# Altium project Thermistor_Expansion_TopBoard.PrjPcb
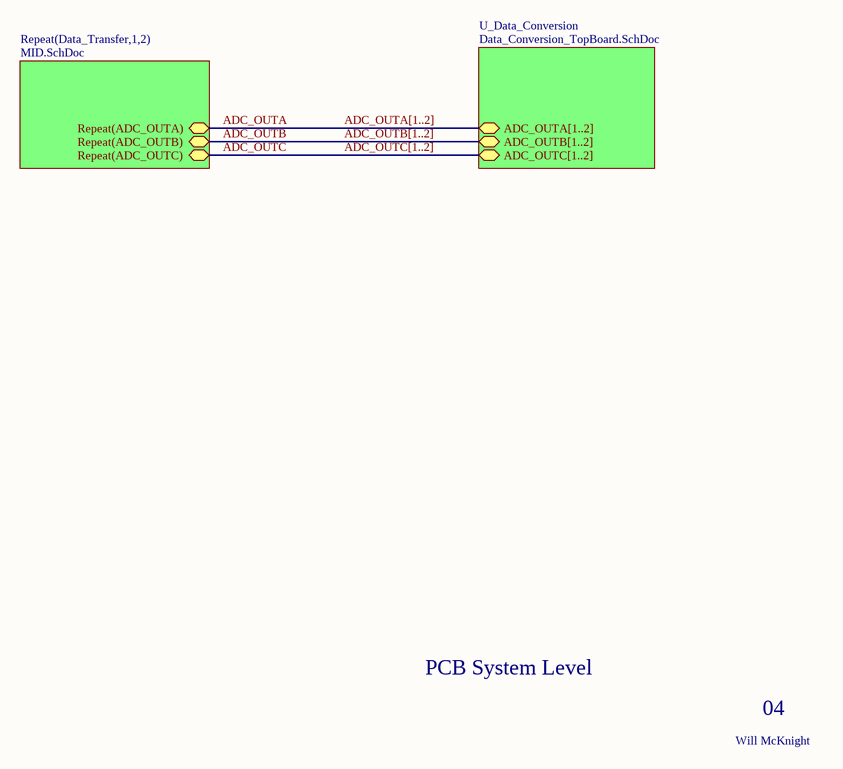
[diagram p0: TOP_Level_Sheet_TopBoard.SchDoc]
5 sheets, 64 parts. Net scope: hierarchical (ports join the sheet entries above them; power ports are global).
Board file: Therm_Expand_PCB_Bottom.PcbDoc
Sheets:
  TOP_Level_Sheet_TopBoard.SchDoc
    Data_Transfer1 = MID.SchDoc
      U_AHK50H-ND_THERM_CONNECTOR = 50Pin_Connector.SchDoc
      U_Single_Mux = Multiplexers.SchDoc
    Data_Transfer2 = MID.SchDoc
      U_AHK50H-ND_THERM_CONNECTOR = 50Pin_Connector.SchDoc
      U_Single_Mux = Multiplexers.SchDoc
    U_Data_Conversion = Data_Conversion_TopBoard.SchDoc

## Sheet TOP_Level_Sheet_TopBoard.SchDoc
size A

### Sub-sheets
Repeat(Data_Transfer,1,2) = MID.SchDoc: Repeat(ADC_OUTA) (bidir), Repeat(ADC_OUTB) (bidir), Repeat(ADC_OUTC) (bidir)
U_Data_Conversion = Data_Conversion_TopBoard.SchDoc: ADC_OUTA[1..2] (bidir), ADC_OUTB[1..2] (bidir), ADC_OUTC[1..2] (bidir)

### Nets
ADC_OUTA: sheet Repeat(Data_Transfer,1,2)/Repeat(ADC_OUTA)
ADC_OUTB: sheet Repeat(Data_Transfer,1,2)/Repeat(ADC_OUTB)
ADC_OUTC: sheet Repeat(Data_Transfer,1,2)/Repeat(ADC_OUTC)

### Buses and harness runs
bus ADC_OUTA[1..2] = sheet U_Data_Conversion/ADC_OUTA[1..2]
bus ADC_OUTB[1..2] = sheet U_Data_Conversion/ADC_OUTB[1..2]
bus ADC_OUTC[1..2] = sheet U_Data_Conversion/ADC_OUTC[1..2]

### Notes on the sheet
- PCB System Level
- 04
- Will McKnight

## Sheet MID.SchDoc
size A
Used 2 times, as channels Data_Transfer1, Data_Transfer2. Parts and nets are listed once, with the designators drawn on the sheet.
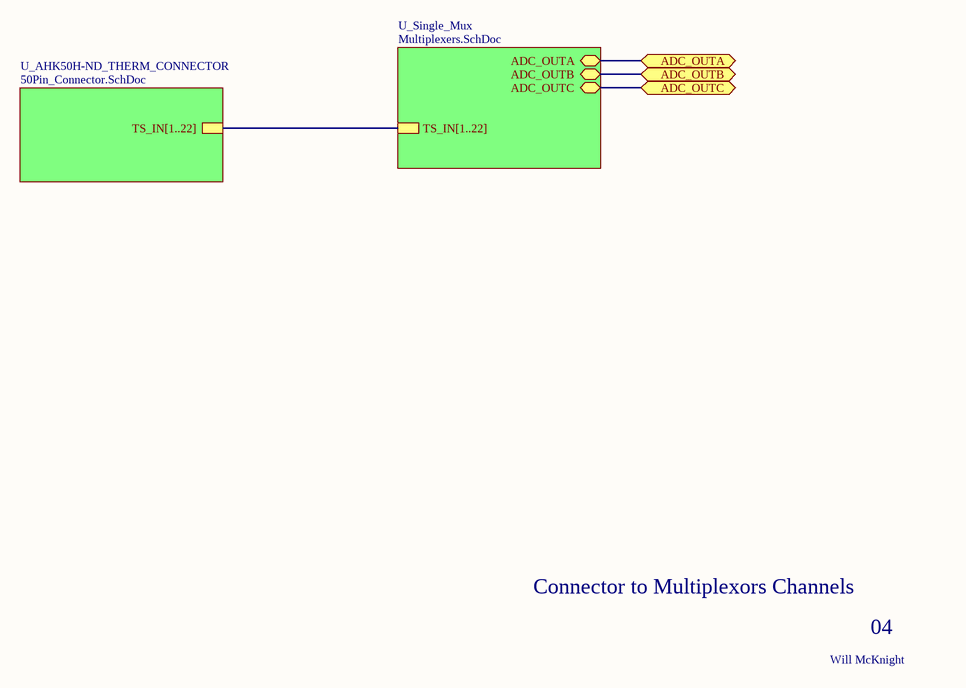
[diagram p1: MID.SchDoc]

### Sub-sheets
U_AHK50H-ND_THERM_CONNECTOR = 50Pin_Connector.SchDoc: TS_IN[1..22]
U_Single_Mux = Multiplexers.SchDoc: ADC_OUTA (bidir), TS_IN[1..22], ADC_OUTB (bidir), ADC_OUTC (bidir)

### Ports
ADC_OUTA (bidir), ADC_OUTB (bidir), ADC_OUTC (bidir)

### Nets
ADC_OUTA: port ADC_OUTA, sheet U_Single_Mux/ADC_OUTA
ADC_OUTB: port ADC_OUTB, sheet U_Single_Mux/ADC_OUTB
ADC_OUTC: port ADC_OUTC, sheet U_Single_Mux/ADC_OUTC

### Channels
Data_Transfer1: ports ADC_OUTA=ADC_OUTA ADC_OUTB=ADC_OUTB ADC_OUTC=ADC_OUTC
Data_Transfer2: ports ADC_OUTA=ADC_OUTA ADC_OUTB=ADC_OUTB ADC_OUTC=ADC_OUTC

### Buses and harness runs
bus sheet U_AHK50H-ND_THERM_CONNECTOR/TS_IN[1..22] = sheet U_Single_Mux/TS_IN[1..22]

### Notes on the sheet
- Connector to Multiplexors Channels
- 04
- Will McKnight

## Sheet 50Pin_Connector.SchDoc
size A; DocumentNumber: 1; SheetNumber: 1; SheetTotal: 5
Used 2 times, as channels Data_Transfer1/U_AHK50H-ND_THERM_CONNECTOR, Data_Transfer2/U_AHK50H-ND_THERM_CONNECTOR. Parts and nets are listed once, with the designators drawn on the sheet.
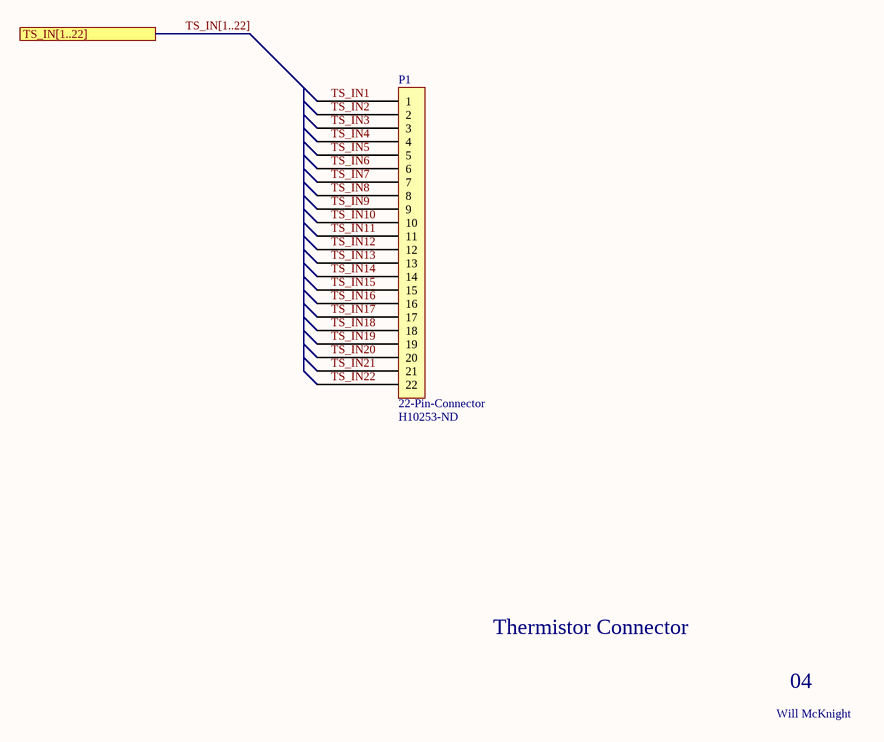
[diagram p2: 50Pin_Connector.SchDoc]

### Parts
P1  22-Pin-Connector  Supplier Part Number 1: H10253-ND  [22-Pin Conenctor]

### Ports
TS_IN[1..22]

### Nets
TS_IN1: P1.1
TS_IN2: P1.2
TS_IN3: P1.3
TS_IN4: P1.4
TS_IN5: P1.5
TS_IN6: P1.6
TS_IN7: P1.7
TS_IN8: P1.8
TS_IN9: P1.9
TS_IN10: P1.10
TS_IN11: P1.11
TS_IN12: P1.12
TS_IN13: P1.13
TS_IN14: P1.14
TS_IN15: P1.15
TS_IN16: P1.16
TS_IN17: P1.17
TS_IN18: P1.18
TS_IN19: P1.19
TS_IN20: P1.20
TS_IN21: P1.21
TS_IN22: P1.22

### Channels
Data_Transfer1/U_AHK50H-ND_THERM_CONNECTOR: designators P1=THERMISTOR_CON_2
Data_Transfer2/U_AHK50H-ND_THERM_CONNECTOR: designators P1=THERMISTOR_CON_1

### Buses and harness runs
bus TS_IN[1..22] = port TS_IN[1..22]

### Notes on the sheet
- Thermistor Connector
- 04
- Will McKnight

### Library data of the parts
P1 = 22-Pin-Connector: Current Therm Connector; Manufacturer: Hirose; Manufacturer Part Number: DF11-22DP-2DS(24); Number of Contacts: 22; Gender: Male; Connector Type: Male Pin; Contact Resistance: 30mR; Max Current Rating: 2A; Voltage Rating: 250V; Pitch: 2mm; Row Spacing: 0.079inch; Supplier 1: Digi-Key; Stock 1: 3536; Pricing 1: 1=1.19, 20=1.0455, 100=0.902, 500=0.738, 1000=0.656 (USD); Mount: Through Hole; Contact Plating: Tin; Contact Material: Brass,Copper Alloy,Tin; Color: Black; Housing Color: Black; Housing Material: Polyamide; Min Operating Temperature: -30°C; Max Operating Temperature: 85°C; Number of Rows: 2; Termination: Solder; Packaging: Rail/Tube; Package Quantity: 20; Fastening Type: Detent; Number of Positions: 22; Current Rating: 2A; Orientation: Right Angle; Length: 24mm; Height: 5mm; Contact Mating Length: 0.118inch; Depth: 10mm; Radiation Hardening: No; Lead Free: Lead Free; ComponentLink1URL: http://docs-usa.electrocomponents.com/techlib:/itc_doclist_US.htm?stockno=6888963&src-supplier=Allied+Electronics; ComponentLink1Description: http://docs-usa.electrocomponents.com/techlib:/itc_doclist_US.htm?stockno=6888963&src-supplier=Allied+Electronics; ComponentLink2URL: https://www.verical.com/server-webapp/html/getDatasheet?partID=456315&src-supplier=Verical; ComponentLink2Description: https://www.verical.com/server-webapp/html/getDatasheet?partID=456315&src-supplier=Verical; ComponentLink3URL: http://www.hirose.co.jp/cataloge_hp/en_DF11_20130411.pdf?src-supplier=Future+Electronics; ComponentLink3Description: http://www.hirose.co.jp/cataloge_hp/en_DF11_20130411.pdf?src-supplier=Future+Electronics; ComponentLink4URL: http://www.farnell.com/datasheets/91550.pdf?src-supplier=Element14; ComponentLink4Description: http://www.farnell.com/datasheets/91550.pdf?src-supplier=Element14; ComponentLink5URL: http://www.mouser.com/ds/2/185/DF11_catalog-1064296.pdf?src-supplier=Mouser; ComponentLink5Description: http://www.mouser.com/ds/2/185/DF11_catalog-1064296.pdf?src-supplier=Mouser; ComponentLink6URL: http://documents.rs-components.com/techlib://itc_doclist_GB.htm?stockno=6056598&src-supplier=RSComponents; ComponentLink6Description: http://documents.rs-components.com/techlib://itc_doclist_GB.htm?stockno=6056598&src-supplier=RSComponents

## Sheet Multiplexers.SchDoc
size A; DocumentNumber: 5; SheetNumber: 5; SheetTotal: 5
Used 2 times, as channels Data_Transfer1/U_Single_Mux, Data_Transfer2/U_Single_Mux. Parts and nets are listed once, with the designators drawn on the sheet.
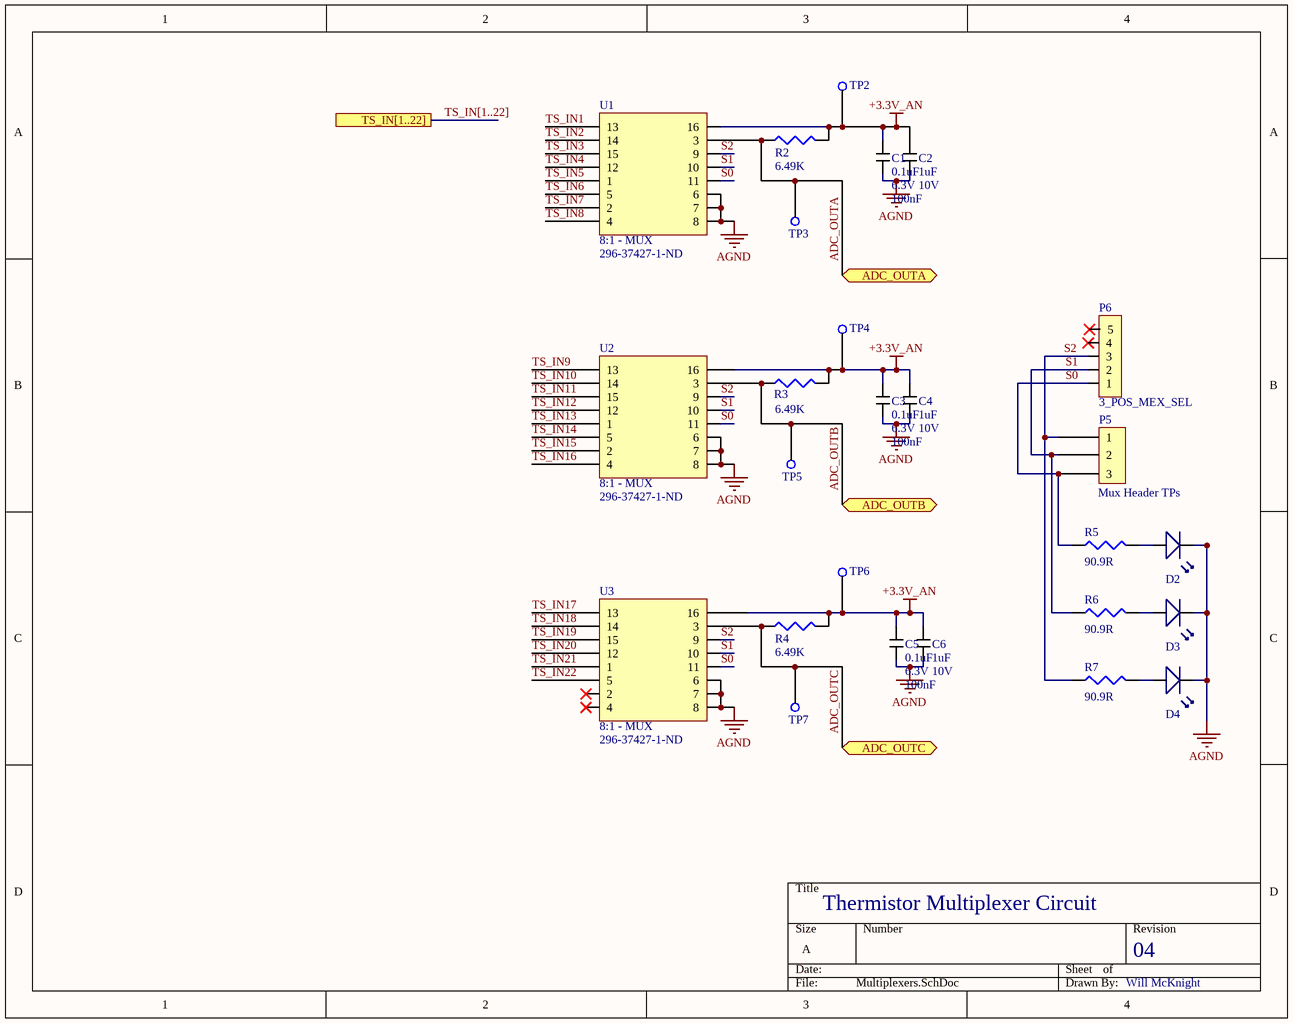
[diagram p3: Multiplexers.SchDoc]

### Parts
C1  0.1uF  Voltage Rating: 6.3V  Capacitance: 100nF  [0.1uF Bypass Capacitor]
C2  Voltage Rating: 10V  [1UF_SAMSUNG]  (hidden comment: 1uF)
C3  0.1uF  Voltage Rating: 6.3V  Capacitance: 100nF  [0.1uF Bypass Capacitor]
C4  Voltage Rating: 10V  [1UF_SAMSUNG]  (hidden comment: 1uF)
C5  0.1uF  Voltage Rating: 6.3V  Capacitance: 100nF  [0.1uF Bypass Capacitor]
C6  Voltage Rating: 10V  [1UF_SAMSUNG]  (hidden comment: 1uF)
D2  LED  [Green_SMD_LED]  (value not drawn)
D3  LED  [Green_SMD_LED]  (value not drawn)
D4  LED  [Green_SMD_LED]  (value not drawn)
P5  3 POS Mux Select Header  [Mux Select 3 Pos Header Pin]  (value not drawn)
P6  3_POS_MEX_SEL  [3POS_MUX_SEL]
R2  Resistance: 6.49K  [RESC2012X06N]  (hidden comment: 6.49kOhm SMD Resistor)
R3  Resistance: 6.49K  [RESC2012X06N]  (hidden comment: 6.49kOhm SMD Resistor)
R4  Resistance: 6.49K  [RESC2012X06N]  (hidden comment: 6.49kOhm SMD Resistor)
R5  Resistance: 90.9R  [Green_LED_Resistor_90.9]  (hidden comment: Green_LED_Res)
R6  Resistance: 90.9R  [Green_LED_Resistor_90.9]  (hidden comment: Green_LED_Res)
R7  Resistance: 90.9R  [Green_LED_Resistor_90.9]  (hidden comment: Green_LED_Res)
TP2  Test Point  [Test Point]  (value not drawn)
TP3  Test Point  [Test Point]  (value not drawn)
TP4  Test Point  [Test Point]  (value not drawn)
TP5  Test Point  [Test Point]  (value not drawn)
TP6  Test Point  [Test Point]  (value not drawn)
TP7  Test Point  [Test Point]  (value not drawn)
U1  8:1 - MUX  Supplier Part Number 1: 296-37427-1-ND  [8x1 16SOIC MUX]
U2  8:1 - MUX  Supplier Part Number 1: 296-37427-1-ND  [8x1 16SOIC MUX]
U3  8:1 - MUX  Supplier Part Number 1: 296-37427-1-ND  [8x1 16SOIC MUX]

### Ports
ADC_OUTA (bidir), ADC_OUTB (bidir), ADC_OUTC (bidir), TS_IN[1..22]

### Nets
+3.3V_AN: C1.2 C2.2 C3.2 C4.2 C5.2 C6.2 R2.2 R3.2 R4.2 TP2.1 TP4.1 TP6.1 U1.16 U2.16 U3.16
AGND: C1.1 C2.1 C3.1 C4.1 C5.1 C6.1 D2.1 D3.1 D4.1 U1.6 U1.7 U1.8 U2.6 U2.7 U2.8 U3.6 U3.7 U3.8
ADC_OUTA: R2.1 TP3.1 U1.3 ; port ADC_OUTA
ADC_OUTB: R3.1 TP5.1 U2.3 ; port ADC_OUTB
ADC_OUTC: R4.1 TP7.1 U3.3 ; port ADC_OUTC
S0: P5.3 P6.1 R5.1 U1.11 U2.11 U3.11
S1: P5.2 P6.2 R6.1 U1.10 U2.10 U3.10
S2: P5.1 P6.3 R7.1 U1.9 U2.9 U3.9
TS_IN1: U1.13
TS_IN2: U1.14
TS_IN3: U1.15
TS_IN4: U1.12
TS_IN5: U1.1
TS_IN6: U1.5
TS_IN7: U1.2
TS_IN8: U1.4
TS_IN9: U2.13
TS_IN10: U2.14
TS_IN11: U2.15
TS_IN12: U2.12
TS_IN13: U2.1
TS_IN14: U2.5
TS_IN15: U2.2
TS_IN16: U2.4
TS_IN17: U3.13
TS_IN18: U3.14
TS_IN19: U3.15
TS_IN20: U3.12
TS_IN21: U3.1
TS_IN22: U3.5
NetD2_2: D2.2 R5.2
NetD3_2: D3.2 R6.2
NetD4_2: D4.2 R7.2

Not connected (* = marked no-connect by the designer): P6 4* 5*; U3 2* 4*

### Channels
Data_Transfer1/U_Single_Mux: designators C1=C1_Mux1 C2=C2_Mux1 C3=C3_Mux1 C4=C4_Mux1 C5=C5_Mux1 C6=C6_Mux1 D2=D2_1 D3=D3_1 D4=D4_1 P5=P5_Data_Transfer1_U_Single_Mux P6=P6_Data_Transfer1_U_Single_Mux R2=R2_Mux1 R3=R3_Mux1 R4=R4_Mux1 R5=R5_1 R6=R6_1 R7=R7_1 TP2=3V3_TEST TP3=TP3_Data_Transfer1_U_Single_Mux TP4=TP4_Data_Transfer1_U_Single_Mux TP5=TP5_Data_Transfer1_U_Single_Mux TP6=TP6_Data_Transfer1_U_Single_Mux TP7=TP7_Data_Transfer1_U_Single_Mux U1=U1_Mux1 U2=U2_Mux1#1 U3=U3_Mux1; ports ADC_OUTA=ADC_OUTA ADC_OUTB=ADC_OUTB ADC_OUTC=ADC_OUTC
Data_Transfer2/U_Single_Mux: designators C1=C1_Mux2 C2=C2_Mux2 C3=C3_Mux2 C4=C4_Mux2 C5=C5_Mux2 C6=C6_Mux2 D2=D2_Data_Transfer2_U_Single_Mux D3=D3_Data_Transfer2_U_Single_Mux D4=D4_Data_Transfer2_U_Single_Mux P5=MUX_SEL_TP P6=MUX_SEL_CON R2=R2_Mux2 R3=R3_Mux2 R4=R4_Mux2 R5=R5_Data_Transfer2_U_Single_Mux R6=R6_Data_Transfer2_U_Single_Mux R7=R7_Data_Transfer2_U_Single_Mux TP2=TP2_Data_Transfer2_U_Single_Mux TP3=TP3_Data_Transfer2_U_Single_Mux TP4=TP4_Data_Transfer2_U_Single_Mux TP5=TP5_Data_Transfer2_U_Single_Mux TP6=TP6_Data_Transfer2_U_Single_Mux TP7=TP7_Data_Transfer2_U_Single_Mux U1=U2_Mux1#2 U2=U2_Mux2 U3=U3_Mux2; ports ADC_OUTA=ADC_OUTA ADC_OUTB=ADC_OUTB ADC_OUTC=ADC_OUTC

### Buses and harness runs
bus TS_IN[1..22] = port TS_IN[1..22]

### Notes on the sheet
- (near P5) Mux Header TPs
- Thermistor Multiplexer Circuit
- 04
- Will McKnight

### Library data of the parts
C1 C3 C5 = 0.1uF Cap: 0.1uF Bypass Cap; Manufacturer: KEMET; Manufacturer Part Number: C0603C104K9RACTU; Dielectric Material: Ceramic; Tolerance: 10%; Dielectric: X7R; Dissipation Factor: 5%; Supplier 1: Digi-Key; Supplier Part Number 1: 399-15351-1-ND; RoHS: Yes; Mount: Surface Mount; Case/Package: 0603; Case Code (Imperial): 0603; Case Code (Metric): 1608; Min Operating Temperature: -55°C; Max Operating Temperature: 125°C; Package Quantity: 4000; Packaging: Tape and Reel; Voltage Rating (DC): 6.3V; Termination: SMD/SMT; Length: 1.6mm; Height: 0.8mm; Width: 0.8mm; Thickness: 0.034inch; ComponentLink1URL: https://datasheet.ciiva.com/13371/kem-c1002-x7r-smd-357932-13371879.pdf?src-supplier=Mouser; ComponentLink1Description: https://datasheet.ciiva.com/13371/kem-c1002-x7r-smd-357932-13371879.pdf?src-supplier=Mouser; Stock 1: 758; Pricing 1: 1=0.19000, 10=0.13800, 100=0.06480, 500=0.04546, 1000=0.03763 (USD)
C2 C4 C6 = 1uF Samsung Cap: Manufacturer Part Number: CL10B105KP8NNNC; Tolerance: 10%; Dielectric: X7R; Supplier 1: Digi-Key; Supplier Part Number 1: 1276-1946-1-ND; Manufacturer: Samsung; Mount: Surface Mount; Case/Package: 0603; Case Code (Metric): 1608; Case Code (Imperial): 0603; Contact Plating: Tin; Min Operating Temperature: -55°C; Max Operating Temperature: 125°C; Package Quantity: 1; Packaging: Tape and Reel; Voltage Rating (DC): 10V; Length: 1.6mm; Height: 0.8mm; Width: 0.031inch; Thickness: 0.035inch; Depth: 0.8mm; Radiation Hardening: No; Lead Free: Lead Free; ComponentLink1URL: https://media.digikey.com/pdf/Data%20Sheets/Samsung%20PDFs/CL_Series_MLCC_ds.pdf?src-supplier=Digi-Key; ComponentLink1Description: https://media.digikey.com/pdf/Data%20Sheets/Samsung%20PDFs/CL_Series_MLCC_ds.pdf?src-supplier=Digi-Key; ComponentLink2URL: http://www1.futureelectronics.com/doc/SAMSUNG/CL10B105KP8NNNC.pdf?src-supplier=Future+Electronics; ComponentLink2Description: http://www1.futureelectronics.com/doc/SAMSUNG/CL10B105KP8NNNC.pdf?src-supplier=Future+Electronics; ComponentLink3URL: https://www.verical.com/server-webapp/html/getDatasheet?partID=358410&src-supplier=Verical; ComponentLink3Description: https://www.verical.com/server-webapp/html/getDatasheet?partID=358410&src-supplier=Verical; Stock 1: 10781730; Pricing 1: 1=0.1, 10=0.052, 100=0.0233, 500=0.0166, 1000=0.0131 (USD); Capacitance: 1uF
D2-D4 = GREEN_LED: Manufacturer: Dialight; Manufacturer Part Number: 5988070107F; Color: Green; Lens Color: Colorless,Clear; Forward Voltage: 2V; Forward Current: 20mA; Wavelength: 570nm; Luminous Intensity: 20mcd; Viewing Angle: 140°; Lens Style: Flat,Rectangular,Diffused,Colorless,Clear; Dominant Wavelength: 568nm; Number of Elements: 1; Power Dissipation: 60mW; Reverse Voltage: 5V; Lens Transparency: Clear; Lens Size: 0.8mm; Supplier 1: Digi-Key; Stock 1: 228546; Pricing 1: 1=0.46, 10=0.33, 25=0.2528, 100=0.1648, 250=0.1209, 500=0.1026, 1000=0.0843 (USD); Mount: Surface Mount; Case/Package: 0603; Number of Pins: 2; Case Code (Metric): 1608; Case Code (Imperial): 0603; Min Operating Temperature: -30°C; Max Operating Temperature: 100°C; Package Quantity: 4000; Packaging: Tape and Reel; Illumination Color: Green; Test Current: 20mA; Number of LEDs: 1; Length: 1.6mm; Height: 0.7mm; Depth: 0.8mm; Width: 0.8mm; Radiation Hardening: No; Lead Free: Lead Free; REACH SVHC: No SVHC; ComponentLink1URL: http://www.mouser.com/ds/2/109/SMT_selector_guide-267443.pdf?src-supplier=Mouser; ComponentLink1Description: http://www.mouser.com/ds/2/109/SMT_selector_guide-267443.pdf?src-supplier=Mouser; ComponentLink2URL: http://uk.rs-online.com/webdocs/0ae2/0900766b80ae2975.pdf?src-supplier=RSComponents; ComponentLink2Description: http://uk.rs-online.com/webdocs/0ae2/0900766b80ae2975.pdf?src-supplier=RSComponents; ComponentLink3URL: http://www.farnell.com/datasheets/1720200.pdf?src-supplier=Element14; ComponentLink3Description: http://www.farnell.com/datasheets/1720200.pdf?src-supplier=Element14; ComponentLink4URL: https://media.digikey.com/pdf/Data%20Sheets/Dialight%20PDFs/598_Series_0603_Pkg.pdf?src-supplier=Digi-Key; ComponentLink4Description: https://media.digikey.com/pdf/Data%20Sheets/Dialight%20PDFs/598_Series_0603_Pkg.pdf?src-supplier=Digi-Key; ComponentLink5URL: http://www.farnell.com/datasheets/1484480.pdf?src-supplier=Element14; ComponentLink5Description: http://www.farnell.com/datasheets/1484480.pdf?src-supplier=Element14; ComponentLink6URL: https://www.alliedelec.com/m/d/745256ca487aea7b70ea31e2d673d5bb.pdf?src-supplier=Allied+Electronics; ComponentLink6Description: https://www.alliedelec.com/m/d/745256ca487aea7b70ea31e2d673d5bb.pdf?src-supplier=Allied+Electronics; ComponentLink7URL: http://www.onlinecomponents.com/productFiles/mf-DIA/mdei5980603.pdf?src-supplier=Onlinecomponents.com; ComponentLink7Description: http://www.onlinecomponents.com/productFiles/mf-DIA/mdei5980603.pdf?src-supplier=Onlinecomponents.com; ComponentLink8URL: https://www.verical.com/server-webapp/html/getDatasheet?partID=146438&src-supplier=Verical; ComponentLink8Description: https://www.verical.com/server-webapp/html/getDatasheet?partID=146438&src-supplier=Verical; ComponentLink9URL: http://www.dialight.com/Assets/Brochures_And_Catalogs/Indication/SMT_selector_guide.pdf?src-supplier=Future+Electronics; ComponentLink9Description: http://www.dialight.com/Assets/Brochures_And_Catalogs/Indication/SMT_selector_guide.pdf?src-supplier=Future+Electronics; Supplier Part Number 1: 350-2035-1-ND
P5 = 3 POS Mux Select Header: Mux Sel Header TP; Manufacturer: Adam Equipment; Manufacturer Part Number: PH1RA-03-UA; Supplier 1: Digi-Key; Stock 1: 4630; Pricing 1: 1=0.12000, 10=0.11300, 100=0.06960, 500=0.05760, 1000=0.05040, 5000=0.04320, 10000=0.04200 (USD); RoHS: Yes; Lead Free: Lead Free; ComponentLink1URL: https://datasheet.ciiva.com/16476/page-292-295-16476086.pdf?src-supplier=Future+Electronics; ComponentLink1Description: https://datasheet.ciiva.com/16476/page-292-295-16476086.pdf?src-supplier=Future+Electronics; Supplier Part Number 1: 2057-PH1RA-03-UA-ND
P6 = 3_POS_MEX_SEL: Connector Header Surface Mount, Right Angle 3 position 0.049" (1.25mm); Manufacturer: Molex; Manufacturer Part Number: 505567-0371; Connector Type: Header,Male Pin; Number of Positions: 3; Supplier 1: Digi-Key; Stock 1: 2041; Pricing 1: 1=0.84000, 10=0.74100, 100=0.63940, 500=0.52312 (USD); RoHS: No; Mount: Surface Mount; Contact Plating: Tin; Contact Material: Brass; Contact Shape: Square; Insulation Material: Nylon; Insulation Color: Black; Min Operating Temperature: -40°C; Max Operating Temperature: 105°C; Fastening Type: Ramp; Packaging: Cut Tape; Number of Rows: 1; Termination: Solder; Flammability Rating: UL94 V-0; ComponentLink1URL: https://www.molex.com/pdm_docs/sd/5055670371_sd.pdf?src-supplier=Digi-Key; ComponentLink1Description: https://www.molex.com/pdm_docs/sd/5055670371_sd.pdf?src-supplier=Digi-Key; ComponentLink2URL: http://www.farnell.com/datasheets/2551041.pdf?src-supplier=Newark; ComponentLink2Description: http://www.farnell.com/datasheets/2551041.pdf?src-supplier=Newark
R2-R4 = 6.49kOhm SMD Resistor: Manufacturer: Panasonic; Manufacturer Part Number: ERA6AEB6491V; Tolerance: 0.1%; Temperature Coefficient: 25ppm/°C; Power Rating: 125mW; Voltage Rating: 100V; Supplier 1: Digi-Key; Stock 1: 15147; Pricing 1: 1=0.36, 10=0.302, 100=0.1182, 1000=0.0495, 2500=0.0454 (USD); Mount: Surface Mount; Case/Package: 0805; Number of Pins: 2; Contact Plating: Tin; Case Code (Metric): 2012; Case Code (Imperial): 0805; Min Operating Temperature: -55°C; Max Operating Temperature: 155°C; Composition: Thin Film,Metal Film; Packaging: Tape and Reel; Package Quantity: 1; Number of Terminations: 2; Termination: SMD/SMT; Military Standard: Not; Max Power Dissipation: 125mW; Voltage Rating (DC): 100V; Features: Automotive AEC-Q200; Length: 2mm; Height: 0.5mm; Width: 1.25mm; Depth: 1.25mm; Radiation Hardening: No; REACH SVHC: No SVHC; Lead Free: Lead Free; ComponentLink1URL: http://www.farnell.com/datasheets/485442.pdf?src-supplier=Farnell; ComponentLink1Description: http://www.farnell.com/datasheets/485442.pdf?src-supplier=Farnell; ComponentLink2URL: http://www.mouser.com/ds/2/315/AOA0000CE26-32660.pdf?src-supplier=Mouser; ComponentLink2Description: http://www.mouser.com/ds/2/315/AOA0000CE26-32660.pdf?src-supplier=Mouser; ComponentLink3URL: http://www.farnell.com/datasheets/2059650.pdf?src-supplier=Farnell; ComponentLink3Description: http://www.farnell.com/datasheets/2059650.pdf?src-supplier=Farnell; ComponentLink4URL: http://uk.rs-online.com/webdocs/0eb1/0900766b80eb1d8c.pdf?src-supplier=RSComponents; ComponentLink4Description: http://uk.rs-online.com/webdocs/0eb1/0900766b80eb1d8c.pdf?src-supplier=RSComponents; ComponentLink5URL: http://www.farnell.com/datasheets/485442.pdf?src-supplier=Element14; ComponentLink5Description: http://www.farnell.com/datasheets/485442.pdf?src-supplier=Element14; ComponentLink6URL: http://www.produktinfo.conrad.com/datenblaetter/1100000-1199999/001181295-da-01-en-WIDERSTAND_ERA_0805_6K49_0_1__5000ST.pdf?src-supplier=Conrad; ComponentLink6Description: http://www.produktinfo.conrad.com/datenblaetter/1100000-1199999/001181295-da-01-en-WIDERSTAND_ERA_0805_6K49_0_1__5000ST.pdf?src-supplier=Conrad; Supplier Part Number 1: P6.49KDACT-ND
R5-R7 = Green_LED_Res: Manufacturer: Panasonic; Manufacturer Part Number: ERJ-1GNF90R9C; Power Rating: 50mW; Tolerance: 1%; Voltage Rating: 25V; Temperature Coefficient: 200ppm/°C; Voltage Rating (DC): 50V; Mount: Surface Mount; Case/Package: 0201; Case Code (Imperial): 0201; Case Code (Metric): 0603; Contact Plating: Tin,Matte; Min Operating Temperature: -55°C; Max Operating Temperature: 125°C; Package Quantity: 15000; Packaging: Tape and Reel; Composition: Thick Film; Number of Terminations: 2; Max Power Dissipation: 50mW; Termination: SMD/SMT; Length: 0.024inch; Height: 0.01inch; Width: 0.3mm; Radiation Hardening: No; Supplier 1: Digi-Key; Stock 1: 401780; Pricing 1: 1=0.10000, 10=0.02400, 100=0.00970, 1000=0.00437, 2500=0.00379 (USD); RoHS: Yes; Military Standard: Not; Depth: 0.8mm; Lead Free: Lead Free; ComponentLink1URL: https://datasheet.ciiva.com/15189/getdatasheetpartid-326528-15189836.pdf?src-supplier=Verical; ComponentLink1Description: https://datasheet.ciiva.com/15189/getdatasheetpartid-326528-15189836.pdf?src-supplier=Verical; ComponentLink2URL: https://datasheet.ciiva.com/12558/rc0603-272842-12558285.pdf?src-supplier=Mouser; ComponentLink2Description: https://datasheet.ciiva.com/12558/rc0603-272842-12558285.pdf?src-supplier=Mouser; Supplier Part Number 1: 311-90.9HRCT-ND
U1-U3 = 8:1 - MUX: Current Therm 8:1 Mux; Manufacturer: Texas Instruments; Manufacturer Part Number: SN74LV4051ATPWRQ1; Max Supply Voltage: 5.5V; Min Supply Voltage: 2V; Bandwidth: 35MHz; Propagation Delay: 7ns; Number of Channels: 1; Number of Inputs: 8; Logic Function: Multiplexer,Demultiplexer; On-State Resistance: 75R; Operating Supply Current: 20uA; Turn-On Delay Time: 20ns; Supply Type: Single; High Level Output Current: 25mA; Supplier 1: Digi-Key; Stock 1: 2492; Pricing 1: 1=0.72000, 10=0.63600, 100=0.48730, 500=0.38522, 1000=0.30818 (USD); Mount: Surface Mount; Case/Package: TSSOP; Number of Pins: 16; Weight: 0.002169oz; Contact Plating: Gold; Min Operating Temperature: -40°C; Max Operating Temperature: 105°C; Package Quantity: 1; Packaging: Tape and Reel; Number of Outputs: 1; Turn-Off Delay Time: 20ns; Number of Circuits: 1; Number of Bits: 8; Low Level Output Current: 25mA; Radiation Hardening: No; REACH SVHC: No SVHC; Lead Free: Lead Free; ComponentLink1URL: http://www.ti.com/lit/ds/symlink/sn74lv4051a-q1.pdf?src-supplier=Digi-Key; ComponentLink1Description: http://www.ti.com/lit/ds/symlink/sn74lv4051a-q1.pdf?src-supplier=Digi-Key; ComponentLink2URL: http://www.ti.com/lit/gpn/sn74lv4051a-q1?src-supplier=Mouser; ComponentLink2Description: http://www.ti.com/lit/gpn/sn74lv4051a-q1?src-supplier=Mouser; ComponentLink3URL: https://www.verical.com/server-webapp/html/getDatasheet?partID=137249&src-supplier=Verical; ComponentLink3Description: https://www.verical.com/server-webapp/html/getDatasheet?partID=137249&src-supplier=Verical; ComponentLink4URL: http://focus.ti.com/lit/ds/symlink/sn74lv4051a-q1.pdf?src-supplier=Avnet; ComponentLink4Description: http://focus.ti.com/lit/ds/symlink/sn74lv4051a-q1.pdf?src-supplier=Avnet; ComponentLink5URL: http://www.produktinfo.conrad.com/datenblaetter/1100000-1199999/001187277-da-01-en-IC_MUX_DE_SN74LV4051ATPWRQ1_TSSOP_16_TID.pdf?src-supplier=Conrad; ComponentLink5Description: http://www.produktinfo.conrad.com/datenblaetter/1100000-1199999/001187277-da-01-en-IC_MUX_DE_SN74LV4051ATPWRQ1_TSSOP_16_TID.pdf?src-supplier=Conrad; RoHS: Yes; -3db Bandwidth: 35MHz; ComponentLink6URL: https://datasheet.ciiva.com/15127/getdatasheetpartid-348177-15127781.pdf?src-supplier=Verical; ComponentLink6Description: https://datasheet.ciiva.com/15127/getdatasheetpartid-348177-15127781.pdf?src-supplier=Verical; ComponentLink7URL: https://datasheet.ciiva.com/14435/sn74lv4051a-q1-14435640.pdf?src-supplier=Avnet; ComponentLink7Description: https://datasheet.ciiva.com/14435/sn74lv4051a-q1-14435640.pdf?src-supplier=Avnet; ComponentLink8URL: https://datasheet.ciiva.com/29645/sn74lv4051a-q1-29645693.pdf?src-supplier=Digi-Key; ComponentLink8Description: https://datasheet.ciiva.com/29645/sn74lv4051a-q1-29645693.pdf?src-supplier=Digi-Key; ComponentLink9URL: https://datasheet.ciiva.com/29645/sn74lv4051a-q1-29645694.pdf?src-supplier=Digi-Key; ComponentLink9Description: https://datasheet.ciiva.com/29645/sn74lv4051a-q1-29645694.pdf?src-supplier=Digi-Key; ComponentLink10URL: https://datasheet.ciiva.com/29645/sn74lv4051a-q1-29645695.pdf?src-supplier=Digi-Key; ComponentLink10Description: https://datasheet.ciiva.com/29645/sn74lv4051a-q1-29645695.pdf?src-supplier=Digi-Key

## Sheet Data_Conversion_TopBoard.SchDoc
size A
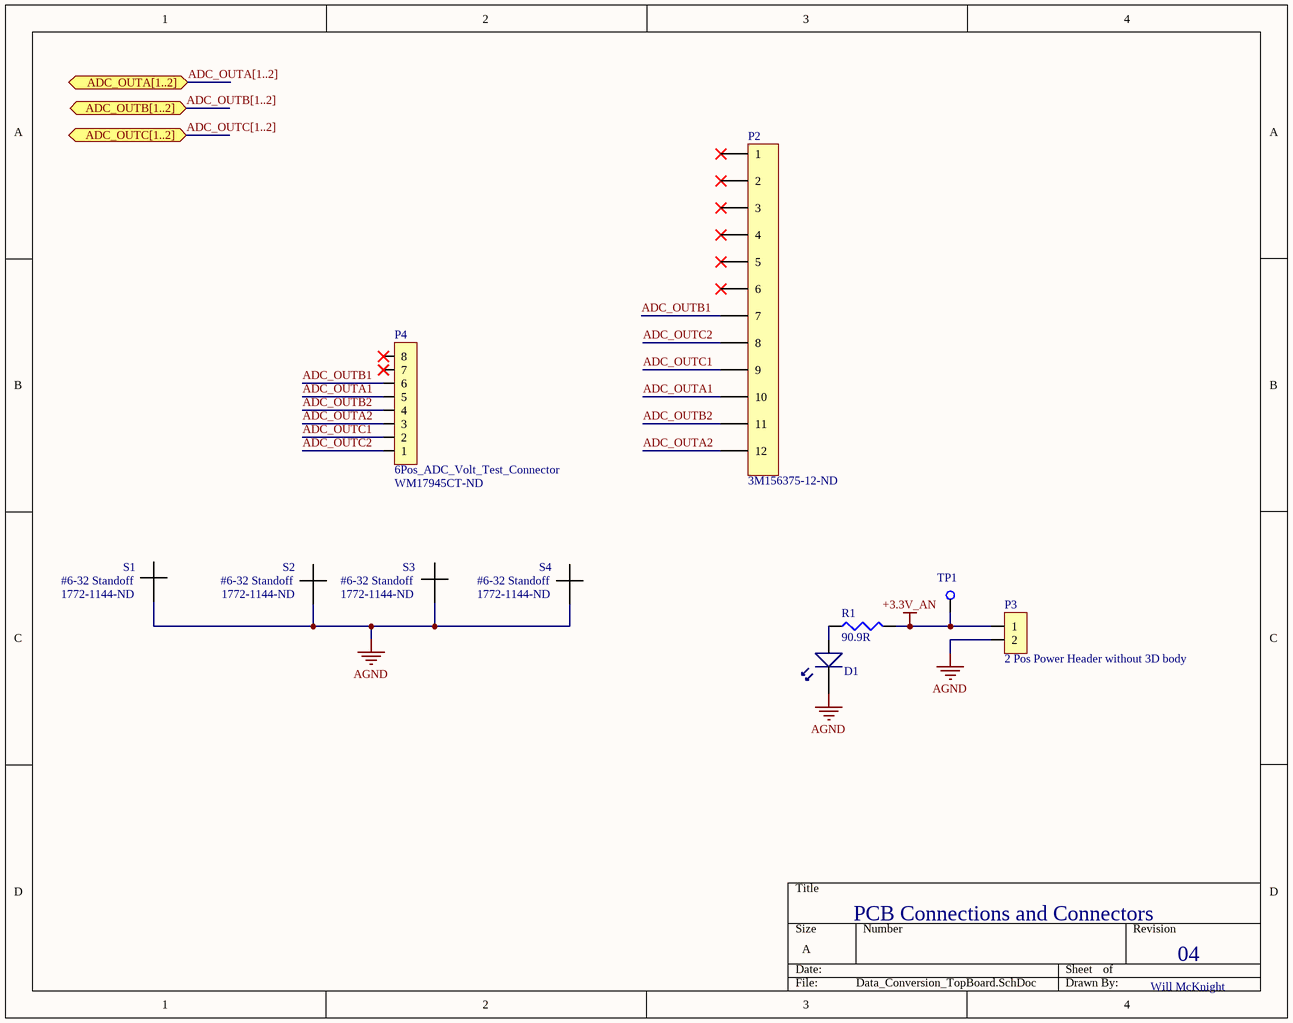
[diagram p4: Data_Conversion_TopBoard.SchDoc]

### Parts
D1  LED  [Green_SMD_LED]  (value not drawn)
P2  Supplier Part Number 1: 3M156375-12-ND  [12POS Dual Header W/O 3D Body]  (hidden comment: 12POS Dual Header W/O 3D Body)
P3  2 Pos Power Header without 3D body  [2 Pos Power Header - duplicate]
P4  6Pos_ADC_Volt_Test_Connector  Supplier Part Number 1: WM17945CT-ND  [6POS_ADC_Volt_TEST]
R1  Resistance: 90.9R  [Green_LED_Resistor_90.9]  (hidden comment: Green)
S1  #6-32 Standoff  Supplier Part Number 1: 1772-1144-ND  [#6-32 Stand Off]
S2  #6-32 Standoff  Supplier Part Number 1: 1772-1144-ND  [#6-32 Stand Off]
S3  #6-32 Standoff  Supplier Part Number 1: 1772-1144-ND  [#6-32 Stand Off]
S4  #6-32 Standoff  Supplier Part Number 1: 1772-1144-ND  [#6-32 Stand Off]
TP1  Test Point  [Test Point]  (value not drawn)

### Ports
ADC_OUTA[1..2] (bidir), ADC_OUTB[1..2] (bidir), ADC_OUTC[1..2] (bidir)

### Nets
+3.3V_AN: P3.1 R1.2 TP1.1
AGND: D1.1 P3.2 S1.1 S2.1 S3.1 S4.1
ADC_OUTA1: P2.10 P4.5  [project net ADC_OUTA]
ADC_OUTA2: P2.12 P4.3  [project net ADC_OUTA]
ADC_OUTB1: P2.7 P4.6  [project net ADC_OUTB]
ADC_OUTB2: P2.11 P4.4  [project net ADC_OUTB]
ADC_OUTC1: P2.9 P4.2  [project net ADC_OUTC]
ADC_OUTC2: P2.8 P4.1  [project net ADC_OUTC]
NetD1_2: D1.2 R1.1

Not connected (* = marked no-connect by the designer): P2 1* 2* 3* 4* 5* 6*; P4 7* 8*

### Buses and harness runs
bus ADC_OUTA[1..2] = port ADC_OUTA[1..2]
bus ADC_OUTB[1..2] = port ADC_OUTB[1..2]
bus ADC_OUTC[1..2] = port ADC_OUTC[1..2]

### Notes on the sheet
- PCB Connections and Connectors
- 04
- Will McKnight

### Library data of the parts
D1 = GREEN_LED: as D2 on sheet Multiplexers; Supplier 1: Digi-Key; Stock 1: 228546; Pricing 1: 1=0.46, 10=0.33, 25=0.2528, 100=0.1648, 250=0.1209, 500=0.1026, 1000=0.0843 (USD); Mount: Surface Mount; Case/Package: 0603; Number of Pins: 2; Case Code (Metric): 1608; Case Code (Imperial): 0603; Min Operating Temperature: -30°C; Max Operating Temperature: 100°C; Package Quantity: 4000; Packaging: Tape and Reel; Illumination Color: Green; Test Current: 20mA; Number of LEDs: 1; Length: 1.6mm; Height: 0.7mm; Depth: 0.8mm; Width: 0.8mm; Radiation Hardening: No; Lead Free: Lead Free; REACH SVHC: No SVHC; ComponentLink1URL: http://www.mouser.com/ds/2/109/SMT_selector_guide-267443.pdf?src-supplier=Mouser; ComponentLink1Description: http://www.mouser.com/ds/2/109/SMT_selector_guide-267443.pdf?src-supplier=Mouser; ComponentLink2URL: http://uk.rs-online.com/webdocs/0ae2/0900766b80ae2975.pdf?src-supplier=RSComponents; ComponentLink2Description: http://uk.rs-online.com/webdocs/0ae2/0900766b80ae2975.pdf?src-supplier=RSComponents; ComponentLink3URL: http://www.farnell.com/datasheets/1720200.pdf?src-supplier=Element14; ComponentLink3Description: http://www.farnell.com/datasheets/1720200.pdf?src-supplier=Element14; ComponentLink4URL: https://media.digikey.com/pdf/Data%20Sheets/Dialight%20PDFs/598_Series_0603_Pkg.pdf?src-supplier=Digi-Key; ComponentLink4Description: https://media.digikey.com/pdf/Data%20Sheets/Dialight%20PDFs/598_Series_0603_Pkg.pdf?src-supplier=Digi-Key; ComponentLink5URL: http://www.farnell.com/datasheets/1484480.pdf?src-supplier=Element14; ComponentLink5Description: http://www.farnell.com/datasheets/1484480.pdf?src-supplier=Element14; ComponentLink6URL: https://www.alliedelec.com/m/d/745256ca487aea7b70ea31e2d673d5bb.pdf?src-supplier=Allied+Electronics; ComponentLink6Description: https://www.alliedelec.com/m/d/745256ca487aea7b70ea31e2d673d5bb.pdf?src-supplier=Allied+Electronics; ComponentLink7URL: http://www.onlinecomponents.com/productFiles/mf-DIA/mdei5980603.pdf?src-supplier=Onlinecomponents.com; ComponentLink7Description: http://www.onlinecomponents.com/productFiles/mf-DIA/mdei5980603.pdf?src-supplier=Onlinecomponents.com; ComponentLink8URL: https://www.verical.com/server-webapp/html/getDatasheet?partID=146438&src-supplier=Verical; ComponentLink8Description: https://www.verical.com/server-webapp/html/getDatasheet?partID=146438&src-supplier=Verical; ComponentLink9URL: http://www.dialight.com/Assets/Brochures_And_Catalogs/Indication/SMT_selector_guide.pdf?src-supplier=Future+Electronics; ComponentLink9Description: http://www.dialight.com/Assets/Brochures_And_Catalogs/Indication/SMT_selector_guide.pdf?src-supplier=Future+Electronics; Supplier Part Number 1: 350-2035-1-ND
P2 = 12POS Dual Header W/O 3D Body: Connector Header Through Hole 12 position 0.100" (2.54mm); Manufacturer: 3M; Manufacturer Part Number: 929715-06-06-EU; Number of Positions: 12; Gender: Male; Connector Type: Male Pin; Pitch: 0.1inch; Supplier 1: Digi-Key; Stock 1: 0; Pricing 1: 1=1.86000, 10=1.69000, 25=1.58600, 50=1.51720, 100=1.44820, 250=1.31024, 500=1.20680 (USD); RoHS: Yes; Mount: Through Hole; Color: Black; Contact Plating: Gold; Package Quantity: 500; Number of Rows: 2; Packaging: Bulk; Termination: Solder; Row Spacing: 0.1inch; Contact Mating Length: 0.318inch; ComponentLink1URL: http://components.arrow.com/part/dataview/42715320S8912076N3321?src-supplier=Arrow; ComponentLink1Description: http://components.arrow.com/part/dataview/42715320S8912076N3321?src-supplier=Arrow; ComponentLink2URL: http://www.mouser.com/ds/2/1/ts0769-35914.pdf?src-supplier=Mouser; ComponentLink2Description: http://www.mouser.com/ds/2/1/ts0769-35914.pdf?src-supplier=Mouser; ComponentLink3URL: http://multimedia.3m.com/mws/mediawebserver?66666UuZjcFSLXTtmXME5x46EVuQEcuZgVs6EVs6E666666--?src-supplier=Digi-Key; ComponentLink3Description: http://multimedia.3m.com/mws/mediawebserver?66666UuZjcFSLXTtmXME5x46EVuQEcuZgVs6EVs6E666666--?src-supplier=Digi-Key
P3 = 2 Pos Power Header without 3D body: No supplier part for this schematic symbol, only here to create board to board holes for the power header
P4 = 6Pos_ADC_Volt_Test_Connector: Connector Header Surface Mount, Right Angle 6 position 0.079" (2.00mm); Manufacturer: Molex; Manufacturer Part Number: 5055780671; Supplier 1: Digi-Key; Stock 1: 3435; Pricing 1: 1=1.02000, 10=0.89300, 100=0.77050 (USD); RoHS: No
R1 = Green_LED_Res: as R5 on sheet Multiplexers; Mount: Surface Mount; Case/Package: 0201; Case Code (Imperial): 0201; Case Code (Metric): 0603; Contact Plating: Tin,Matte; Min Operating Temperature: -55°C; Max Operating Temperature: 125°C; Package Quantity: 15000; Packaging: Tape and Reel; Composition: Thick Film; Number of Terminations: 2; Max Power Dissipation: 50mW; Termination: SMD/SMT; Length: 0.024inch; Height: 0.01inch; Width: 0.3mm; Radiation Hardening: No; Supplier 1: Digi-Key; Stock 1: 401780; Pricing 1: 1=0.10000, 10=0.02400, 100=0.00970, 1000=0.00437, 2500=0.00379 (USD); RoHS: Yes; Military Standard: Not; Depth: 0.8mm; Lead Free: Lead Free; ComponentLink1URL: https://datasheet.ciiva.com/15189/getdatasheetpartid-326528-15189836.pdf?src-supplier=Verical; ComponentLink1Description: https://datasheet.ciiva.com/15189/getdatasheetpartid-326528-15189836.pdf?src-supplier=Verical; ComponentLink2URL: https://datasheet.ciiva.com/12558/rc0603-272842-12558285.pdf?src-supplier=Mouser; ComponentLink2Description: https://datasheet.ciiva.com/12558/rc0603-272842-12558285.pdf?src-supplier=Mouser; Supplier Part Number 1: 311-90.9HRCT-ND
S1-S4 = #6-32 Standoff: Hex Standoff for Thermistor Boards; Manufacturer: RAF; Manufacturer Part Number: 2102T-632-AL-7; System: Connector; Supplier 1: Digi-Key; Stock 1: 1687; Pricing 1: 1=0.5, 25=0.3328, 100=0.2834, 250=0.2692, 500=0.2551, 1000=0.2409 (USD); Package Quantity: 100

## Nets that join several sheets
+3.3V_AN: Data_Transfer1/U_Single_Mux (15 pins), Data_Transfer2/U_Single_Mux (15 pins), Data_Conversion_TopBoard (P3.1 R1.2 TP1.1)
AGND: Data_Transfer1/U_Single_Mux (18 pins), Data_Transfer2/U_Single_Mux (18 pins), Data_Conversion_TopBoard (6 pins)
ADC_OUTA: Data_Transfer1/U_Single_Mux (R2_Mux1.1 TP3_Data_Transfer1_U_Single_Mux.1 U1_Mux1.3), Data_Conversion_TopBoard (P2.10 P4.5)
ADC_OUTA: Data_Transfer2/U_Single_Mux (R2_Mux2.1 TP3_Data_Transfer2_U_Single_Mux.1 U2_Mux1#2.3), Data_Conversion_TopBoard (P2.12 P4.3)
ADC_OUTB: Data_Transfer1/U_Single_Mux (R3_Mux1.1 TP5_Data_Transfer1_U_Single_Mux.1 U2_Mux1#1.3), Data_Conversion_TopBoard (P2.7 P4.6)
ADC_OUTB: Data_Transfer2/U_Single_Mux (R3_Mux2.1 TP5_Data_Transfer2_U_Single_Mux.1 U2_Mux2.3), Data_Conversion_TopBoard (P2.11 P4.4)
ADC_OUTC: Data_Transfer1/U_Single_Mux (R4_Mux1.1 TP7_Data_Transfer1_U_Single_Mux.1 U3_Mux1.3), Data_Conversion_TopBoard (P2.9 P4.2)
ADC_OUTC: Data_Transfer2/U_Single_Mux (R4_Mux2.1 TP7_Data_Transfer2_U_Single_Mux.1 U3_Mux2.3), Data_Conversion_TopBoard (P2.8 P4.1)
TS_IN1: Data_Transfer1/U_AHK50H-ND_THERM_CONNECTOR (THERMISTOR_CON_2.1), Data_Transfer1/U_Single_Mux (U1_Mux1.13)
TS_IN1: Data_Transfer2/U_AHK50H-ND_THERM_CONNECTOR (THERMISTOR_CON_1.1), Data_Transfer2/U_Single_Mux (U2_Mux1#2.13)
TS_IN2: Data_Transfer1/U_AHK50H-ND_THERM_CONNECTOR (THERMISTOR_CON_2.2), Data_Transfer1/U_Single_Mux (U1_Mux1.14)
TS_IN2: Data_Transfer2/U_AHK50H-ND_THERM_CONNECTOR (THERMISTOR_CON_1.2), Data_Transfer2/U_Single_Mux (U2_Mux1#2.14)
TS_IN3: Data_Transfer1/U_AHK50H-ND_THERM_CONNECTOR (THERMISTOR_CON_2.3), Data_Transfer1/U_Single_Mux (U1_Mux1.15)
TS_IN3: Data_Transfer2/U_AHK50H-ND_THERM_CONNECTOR (THERMISTOR_CON_1.3), Data_Transfer2/U_Single_Mux (U2_Mux1#2.15)
TS_IN4: Data_Transfer1/U_AHK50H-ND_THERM_CONNECTOR (THERMISTOR_CON_2.4), Data_Transfer1/U_Single_Mux (U1_Mux1.12)
TS_IN4: Data_Transfer2/U_AHK50H-ND_THERM_CONNECTOR (THERMISTOR_CON_1.4), Data_Transfer2/U_Single_Mux (U2_Mux1#2.12)
TS_IN5: Data_Transfer1/U_AHK50H-ND_THERM_CONNECTOR (THERMISTOR_CON_2.5), Data_Transfer1/U_Single_Mux (U1_Mux1.1)
TS_IN5: Data_Transfer2/U_AHK50H-ND_THERM_CONNECTOR (THERMISTOR_CON_1.5), Data_Transfer2/U_Single_Mux (U2_Mux1#2.1)
TS_IN6: Data_Transfer1/U_AHK50H-ND_THERM_CONNECTOR (THERMISTOR_CON_2.6), Data_Transfer1/U_Single_Mux (U1_Mux1.5)
TS_IN6: Data_Transfer2/U_AHK50H-ND_THERM_CONNECTOR (THERMISTOR_CON_1.6), Data_Transfer2/U_Single_Mux (U2_Mux1#2.5)
TS_IN7: Data_Transfer1/U_AHK50H-ND_THERM_CONNECTOR (THERMISTOR_CON_2.7), Data_Transfer1/U_Single_Mux (U1_Mux1.2)
TS_IN7: Data_Transfer2/U_AHK50H-ND_THERM_CONNECTOR (THERMISTOR_CON_1.7), Data_Transfer2/U_Single_Mux (U2_Mux1#2.2)
TS_IN8: Data_Transfer1/U_AHK50H-ND_THERM_CONNECTOR (THERMISTOR_CON_2.8), Data_Transfer1/U_Single_Mux (U1_Mux1.4)
TS_IN8: Data_Transfer2/U_AHK50H-ND_THERM_CONNECTOR (THERMISTOR_CON_1.8), Data_Transfer2/U_Single_Mux (U2_Mux1#2.4)
TS_IN9: Data_Transfer1/U_AHK50H-ND_THERM_CONNECTOR (THERMISTOR_CON_2.9), Data_Transfer1/U_Single_Mux (U2_Mux1#1.13)
TS_IN9: Data_Transfer2/U_AHK50H-ND_THERM_CONNECTOR (THERMISTOR_CON_1.9), Data_Transfer2/U_Single_Mux (U2_Mux2.13)
TS_IN10: Data_Transfer1/U_AHK50H-ND_THERM_CONNECTOR (THERMISTOR_CON_2.10), Data_Transfer1/U_Single_Mux (U2_Mux1#1.14)
TS_IN10: Data_Transfer2/U_AHK50H-ND_THERM_CONNECTOR (THERMISTOR_CON_1.10), Data_Transfer2/U_Single_Mux (U2_Mux2.14)
TS_IN11: Data_Transfer1/U_AHK50H-ND_THERM_CONNECTOR (THERMISTOR_CON_2.11), Data_Transfer1/U_Single_Mux (U2_Mux1#1.15)
TS_IN11: Data_Transfer2/U_AHK50H-ND_THERM_CONNECTOR (THERMISTOR_CON_1.11), Data_Transfer2/U_Single_Mux (U2_Mux2.15)
TS_IN12: Data_Transfer1/U_AHK50H-ND_THERM_CONNECTOR (THERMISTOR_CON_2.12), Data_Transfer1/U_Single_Mux (U2_Mux1#1.12)
TS_IN12: Data_Transfer2/U_AHK50H-ND_THERM_CONNECTOR (THERMISTOR_CON_1.12), Data_Transfer2/U_Single_Mux (U2_Mux2.12)
TS_IN13: Data_Transfer1/U_AHK50H-ND_THERM_CONNECTOR (THERMISTOR_CON_2.13), Data_Transfer1/U_Single_Mux (U2_Mux1#1.1)
TS_IN13: Data_Transfer2/U_AHK50H-ND_THERM_CONNECTOR (THERMISTOR_CON_1.13), Data_Transfer2/U_Single_Mux (U2_Mux2.1)
TS_IN14: Data_Transfer1/U_AHK50H-ND_THERM_CONNECTOR (THERMISTOR_CON_2.14), Data_Transfer1/U_Single_Mux (U2_Mux1#1.5)
TS_IN14: Data_Transfer2/U_AHK50H-ND_THERM_CONNECTOR (THERMISTOR_CON_1.14), Data_Transfer2/U_Single_Mux (U2_Mux2.5)
TS_IN15: Data_Transfer1/U_AHK50H-ND_THERM_CONNECTOR (THERMISTOR_CON_2.15), Data_Transfer1/U_Single_Mux (U2_Mux1#1.2)
TS_IN15: Data_Transfer2/U_AHK50H-ND_THERM_CONNECTOR (THERMISTOR_CON_1.15), Data_Transfer2/U_Single_Mux (U2_Mux2.2)
TS_IN16: Data_Transfer1/U_AHK50H-ND_THERM_CONNECTOR (THERMISTOR_CON_2.16), Data_Transfer1/U_Single_Mux (U2_Mux1#1.4)
TS_IN16: Data_Transfer2/U_AHK50H-ND_THERM_CONNECTOR (THERMISTOR_CON_1.16), Data_Transfer2/U_Single_Mux (U2_Mux2.4)
TS_IN17: Data_Transfer1/U_AHK50H-ND_THERM_CONNECTOR (THERMISTOR_CON_2.17), Data_Transfer1/U_Single_Mux (U3_Mux1.13)
TS_IN17: Data_Transfer2/U_AHK50H-ND_THERM_CONNECTOR (THERMISTOR_CON_1.17), Data_Transfer2/U_Single_Mux (U3_Mux2.13)
TS_IN18: Data_Transfer1/U_AHK50H-ND_THERM_CONNECTOR (THERMISTOR_CON_2.18), Data_Transfer1/U_Single_Mux (U3_Mux1.14)
TS_IN18: Data_Transfer2/U_AHK50H-ND_THERM_CONNECTOR (THERMISTOR_CON_1.18), Data_Transfer2/U_Single_Mux (U3_Mux2.14)
TS_IN19: Data_Transfer1/U_AHK50H-ND_THERM_CONNECTOR (THERMISTOR_CON_2.19), Data_Transfer1/U_Single_Mux (U3_Mux1.15)
TS_IN19: Data_Transfer2/U_AHK50H-ND_THERM_CONNECTOR (THERMISTOR_CON_1.19), Data_Transfer2/U_Single_Mux (U3_Mux2.15)
TS_IN20: Data_Transfer1/U_AHK50H-ND_THERM_CONNECTOR (THERMISTOR_CON_2.20), Data_Transfer1/U_Single_Mux (U3_Mux1.12)
TS_IN20: Data_Transfer2/U_AHK50H-ND_THERM_CONNECTOR (THERMISTOR_CON_1.20), Data_Transfer2/U_Single_Mux (U3_Mux2.12)
TS_IN21: Data_Transfer1/U_AHK50H-ND_THERM_CONNECTOR (THERMISTOR_CON_2.21), Data_Transfer1/U_Single_Mux (U3_Mux1.1)
TS_IN21: Data_Transfer2/U_AHK50H-ND_THERM_CONNECTOR (THERMISTOR_CON_1.21), Data_Transfer2/U_Single_Mux (U3_Mux2.1)
TS_IN22: Data_Transfer1/U_AHK50H-ND_THERM_CONNECTOR (THERMISTOR_CON_2.22), Data_Transfer1/U_Single_Mux (U3_Mux1.5)
TS_IN22: Data_Transfer2/U_AHK50H-ND_THERM_CONNECTOR (THERMISTOR_CON_1.22), Data_Transfer2/U_Single_Mux (U3_Mux2.5)